# EAGLE schematic iofresh (EAGLE 9.6.2)
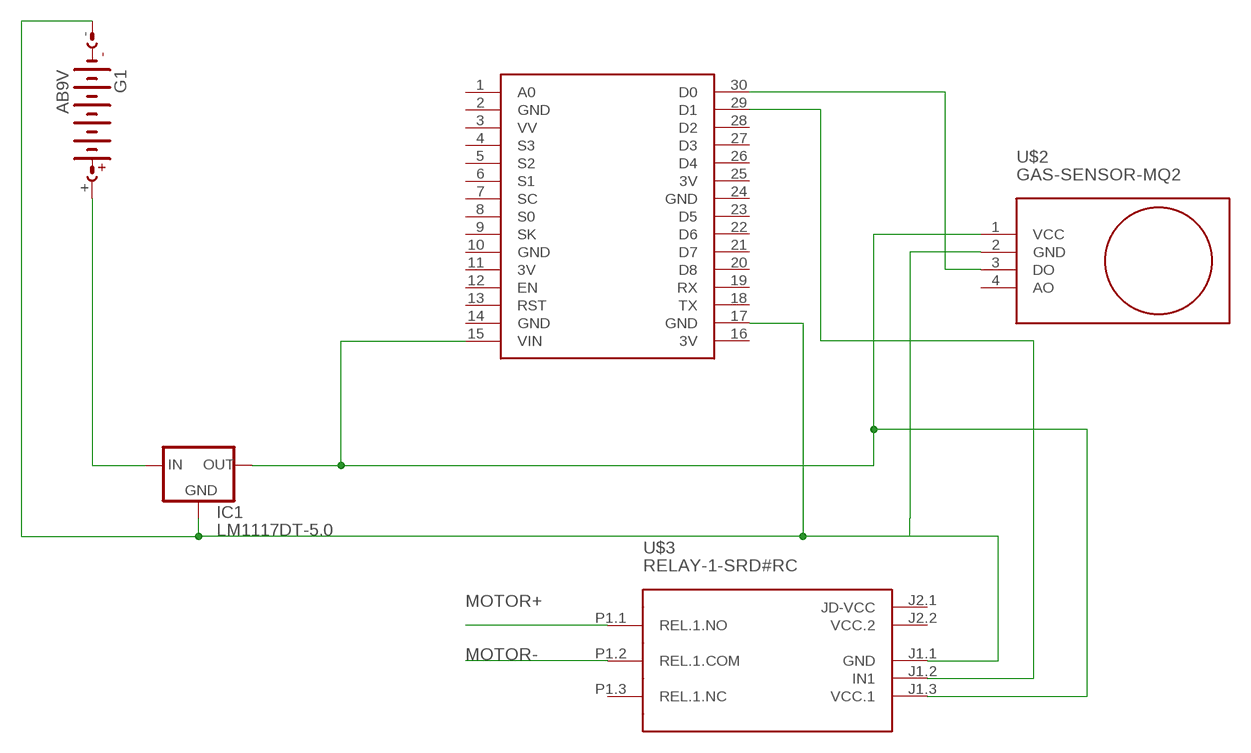
[diagram p0: schematic, sheet 1]

## Parts
G1  AB9V  [AB9V]
IC1  LM1117DT-5.0  [TO252]
U$1  NODEMCU  [NODEMCU]
U$2  GAS-SENSOR-MQ2  [GAS-SENSOR-MQ2]
U$3  RELAY-1-SRD#RC  [RELAY-1-SRD#RC]

## Nets
MOTOR+: U$3.P1.1(REL.1.NO)
MOTOR-: U$3.P1.2(REL.1.COM)
N$1: G1.+ IC1.2(IN)
N$2: IC1.3(OUT) U$1.15(VIN) U$2.1(VCC) U$3.J1.3(VCC.1)
N$3: G1.- IC1.1(GND) U$1.17(GND) U$2.2(GND) U$3.J1.1(GND)
N$6: U$1.30(D0) U$2.3(DO)
N$7: U$1.29(D1) U$3.J1.2(IN1)
Unconnected: U$1.1(A0) U$1.3(VV) U$1.4(S3) U$1.5(S2) U$1.6(S1) U$1.7(SC) U$1.8(S0) U$1.9(SK) U$1.12(EN) U$1.13(RST) U$1.18(TX) U$1.19(RX) U$1.20(D8) U$1.21(D7) U$1.22(D6) U$1.23(D5) U$1.26(D4) U$1.27(D3) U$1.28(D2) U$2.4(AO) U$3.J2.1(JD-VCC) U$3.P1.3(REL.1.NC)

## Power pins joined to a net without a drawn wire
3V: U$1.11(3V) U$1.16(3V) U$1.25(3V)
GND: U$1.2(GND) U$1.10(GND) U$1.14(GND) U$1.24(GND)
VCC.2: U$3.J2.2(VCC.2)

## Library data of the parts
G1 = battery:AB9V: 9-V BATTERY CLIP
IC1 = lm1117_10:LM1117?-*: 800mA Low-Dropout Linear Regulator Source: http://www.ti.com/lit/ds/symlink/lm1117-n.pdf; MF: Texas Instruments; MPN: LM1117DT-5.0; OC_FARNELL: 9486283; OC_NEWARK: 41K3431
U$1 = nodemcu:NODEMCU
U$2 = diy-modules:GAS-SENSOR-MQ2: Gas Sensor based on MQ-2 device Guide describing how to use MQ-2 sensor with Arduino is available here: http://www.instructables.com/id/How-to-use-MQ2-Gas-Sensor-Arduino-Tutorial/ MQ-2 sensor datasheet is available here: http://gas-sensor.ru/pdf/combustible-gas-sensor.pdf Click here to find device on ebay.com <http://www.ebay.com/sch/mq2+sensor+module+smoke>
U$3 = diy-modules:RELAY-1-SRD#RC: 1-Channel Relay Module based on SRD-05VDC-SL-C relays Symbol with relays pins Click here to find device on ebay.com <http://www.ebay.com/sch/one+channel+isolated+relay+5v>